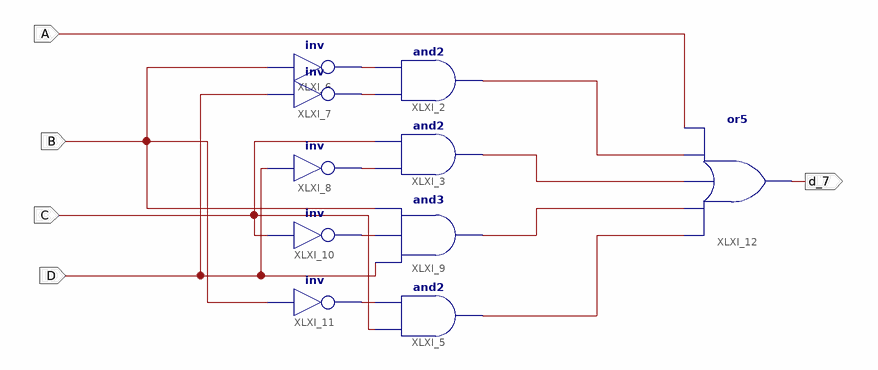
[diagram p0: schematic sheet 1]
// Xilinx ISE schematic bcd_for_d.sch (spartan6) as structural Verilog: 10 symbols, 5 ports
module bcd_for_d (
  input  D,
  input  C,
  input  B,
  input  A,
  output d_7
);

  wire XLXN_1, XLXN_2, XLXN_3, XLXN_4, XLXN_5, XLXN_6, XLXN_7, XLXN_8, XLXN_9;

  and XLXI_2 (XLXN_1, XLXN_6, XLXN_5);
  and XLXI_3 (XLXN_2, XLXN_7, C);
  and XLXI_5 (XLXN_4, C, XLXN_9);
  not XLXI_6 (XLXN_5, B);
  not XLXI_7 (XLXN_6, D);
  not XLXI_8 (XLXN_7, D);
  and XLXI_9 (XLXN_3, D, XLXN_8, B);
  not XLXI_10 (XLXN_8, C);
  not XLXI_11 (XLXN_9, B);
  or XLXI_12 (d_7, XLXN_4, XLXN_3, XLXN_2, XLXN_1, A);
endmodule
